# EAGLE design PULSE_OXIMETER_SHIELD (EAGLE 7.6.0)
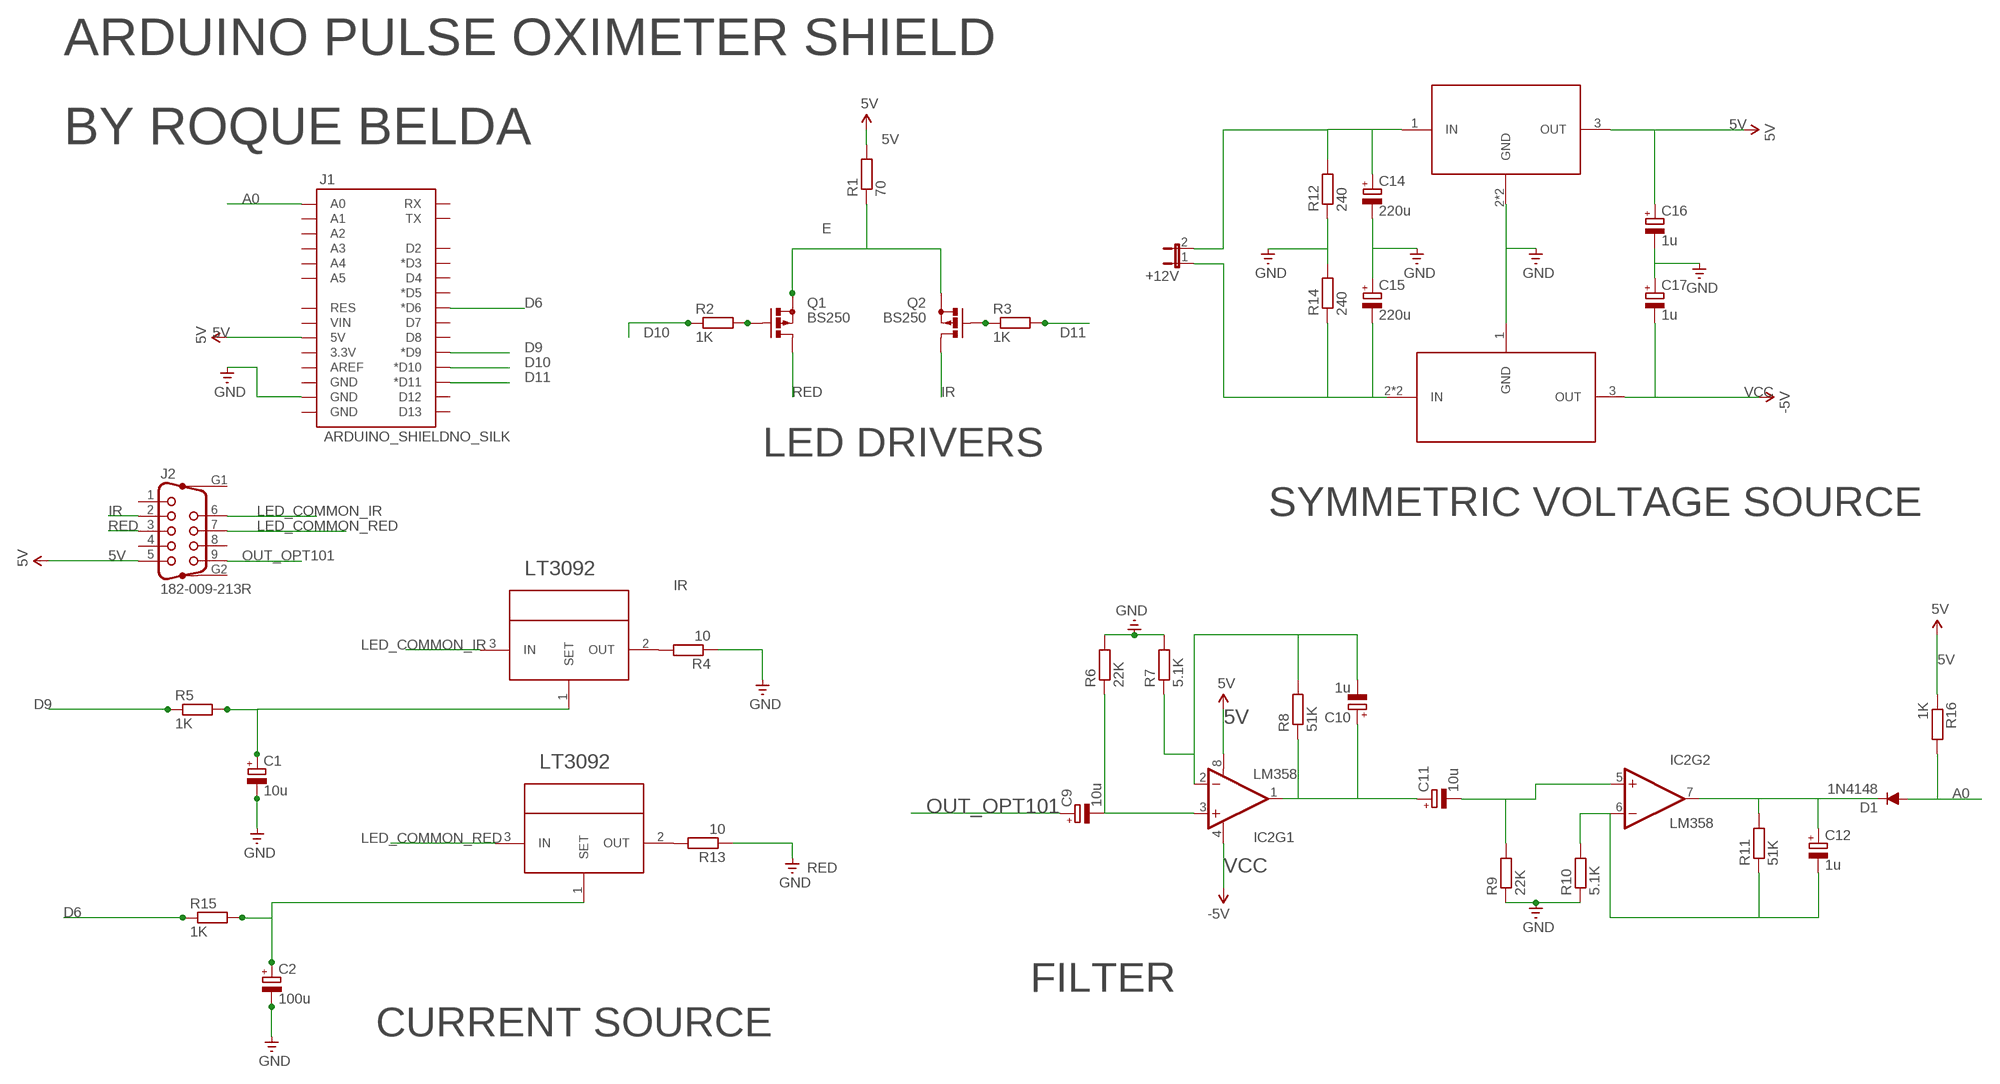
[diagram p0: schematic, sheet 1]

## Parts
+12V  JP1E  [JP1]
C1  10u  CPOL-EUE2.5-6  [E2,5-6]
C2  100u  CPOL-EUE2.5-6  [E2,5-6]
C9  10u  CPOL-EUE2.5-6  [E2,5-6]
C10  1u  CPOL-EUE2.5-6  [E2,5-6]
C11  10u  CPOL-EUE2.5-6  [E2,5-6]
C12  1u  CPOL-EUE2.5-6  [E2,5-6]
C14  220u  CPOL-EUE3.5-8  [E3,5-8]
C15  220u  CPOL-EUE3.5-8  [E3,5-8]
C16  1u  CPOL-EUE2.5-6  [E2,5-6]
C17  1u  CPOL-EUE2.5-6  [E2,5-6]
D1  1N4148  [DO35-10]
IC2  LM358  [DIP08]
J1  ARDUINO_SHIELDNO_SILK  [DUEMILANOVE_VIAS]
J2  182-009-213R  [182-009-213R]
Q1  BS250  [SOT54E]
Q2  BS250  [SOT54E]
R1  70  R-EU_0204/5  [0204/5]
R2  1K  R-EU_0204/5  [0204/5]
R3  1K  R-EU_0204/5  [0204/5]
R4  10  R-EU_0204/5  [0204/5]
R5  1K  R-EU_0204/5  [0204/5]
R6  22K  R-EU_0204/5  [0204/5]
R7  5.1K  R-EU_0204/5  [0204/5]
R8  51K  R-EU_0204/5  [0204/5]
R9  22K  R-EU_0204/5  [0204/5]
R10  5.1K  R-EU_0204/5  [0204/5]
R11  51K  R-EU_0204/5  [0204/5]
R12  240  R-EU_0204/5  [0204/5]
R13  10  R-EU_0204/5  [0204/5]
R14  240  R-EU_0204/5  [0204/5]
R15  1K  R-EU_0204/5  [0204/5]
R16  1K  R-EU_0204/5  [0204/5]
U$1  LT3092  [SOT223]
U$2  UA78M05  [SOT223]
U$3  UA79M05  [TO263-3]
U$4  LT3092  [SOT223]

## Nets
5V: C16.+ IC2.8(V+) J1.5V J2.5 R1.2 R16.1 U$2.3(OUT)
A0: D1.A J1.A0 R16.2
C10: C10.+ C11.+ IC2.1(OUT) R8.1
D6: J1.D6(*D6) R15.1
D9: J1.D9(*D9) R5.1
D10: J1.D10(*D10) R2.1
D11: J1.D11(*D11) R3.2
E: Q1.S Q2.S R1.1
GND: C1.- C2.- C14.- C15.+ J1.GND@1(GND) R4.1 R6.2 R7.2 R9.1 R10.1 R13.1 U$2.2(GND) U$2.4(GND) U$3.1(GND)
IR: J2.2 Q2.D
LED_COMMON_IR: J2.6 U$1.3(IN)
LED_COMMON_RED: J2.7 U$4.3(IN)
N$1: Q1.G R2.2
N$2: Q2.G R3.1
N$3: R4.2 U$1.2(OUT)
N$4: C2.+ R15.2 U$4.1(SET)
N$5: C1.+ R5.2 U$1.1(SET)
N$6: C11.- IC2.5(+IN) R9.2
N$7: R13.2 U$4.2(OUT)
N$8: C12.+ D1.C IC2.7(OUT) R11.2
N$9: C16.- C17.+
N$10: +12V.2 C14.+ R12.2 U$2.1(IN)
N$11: R12.1 R14.2
N$12: +12V.1 C15.- R14.1 U$3.2(IN) U$3.4(IN)
N$17: C10.- IC2.2(-IN) R7.1 R8.2
N$20: C9.- IC2.3(+IN) R6.1
OUT_OPT101: C9.+ J2.9
R11: C12.- IC2.6(-IN) R10.2 R11.1
RED: J2.3 Q1.D
VCC: C17.- IC2.4(V-) U$3.3(OUT) ; supply symbol labelled -5V
Unconnected: J1.3.3V J1.A1 J1.A2 J1.A3 J1.A4 J1.A5 J1.AREF J1.D2 J1.D3(*D3) J1.D4 J1.D5(*D5) J1.D7 J1.D8 J1.D12 J1.D13 J1.GND@0(GND) J1.GND@2(GND) J1.RES J1.RX J1.TX J1.VIN J2.1 J2.4 J2.8 J2.G1 J2.G2

## Notes on the sheet
- ARDUINO PULSE OXIMETER SHIELD
- BY ROQUE BELDA
- LED DRIVERS
- SYMMETRIC VOLTAGE SOURCE
- IR
- RED
- FILTER
- CURRENT SOURCE

## Library data of the parts
+12V = jumper:JP1E: JUMPER
C1 C2 C9-C12 C14-C17 = resistor:CPOL-EU: POLARIZED CAPACITOR, European symbol
D1 = diode (2):1N4148: DIODE high speed (Philips)
IC2 = SparkFun-AnalogIC:LM358: Jellybean op-amp; PROD_ID: IC-09172
J1 = SparkFun-Boards:ARDUINO_SHIELD: Arduino shield footprint
J2 = con-subd (2):182-009-213R: CONN DB9 FEMALE .318" R/A NICKEL
Q1 Q2 = transistor-small-signal:BS250: P-CHANNEL MOS FET
R1-R16 = rcl:R-EU_: RESISTOR, European symbol
U$1 U$4 = transistor-npn:LT3092
U$2 = transistor-npn:UA78M05
U$3 = lm1084-adj-to263:UA79M05

## Board
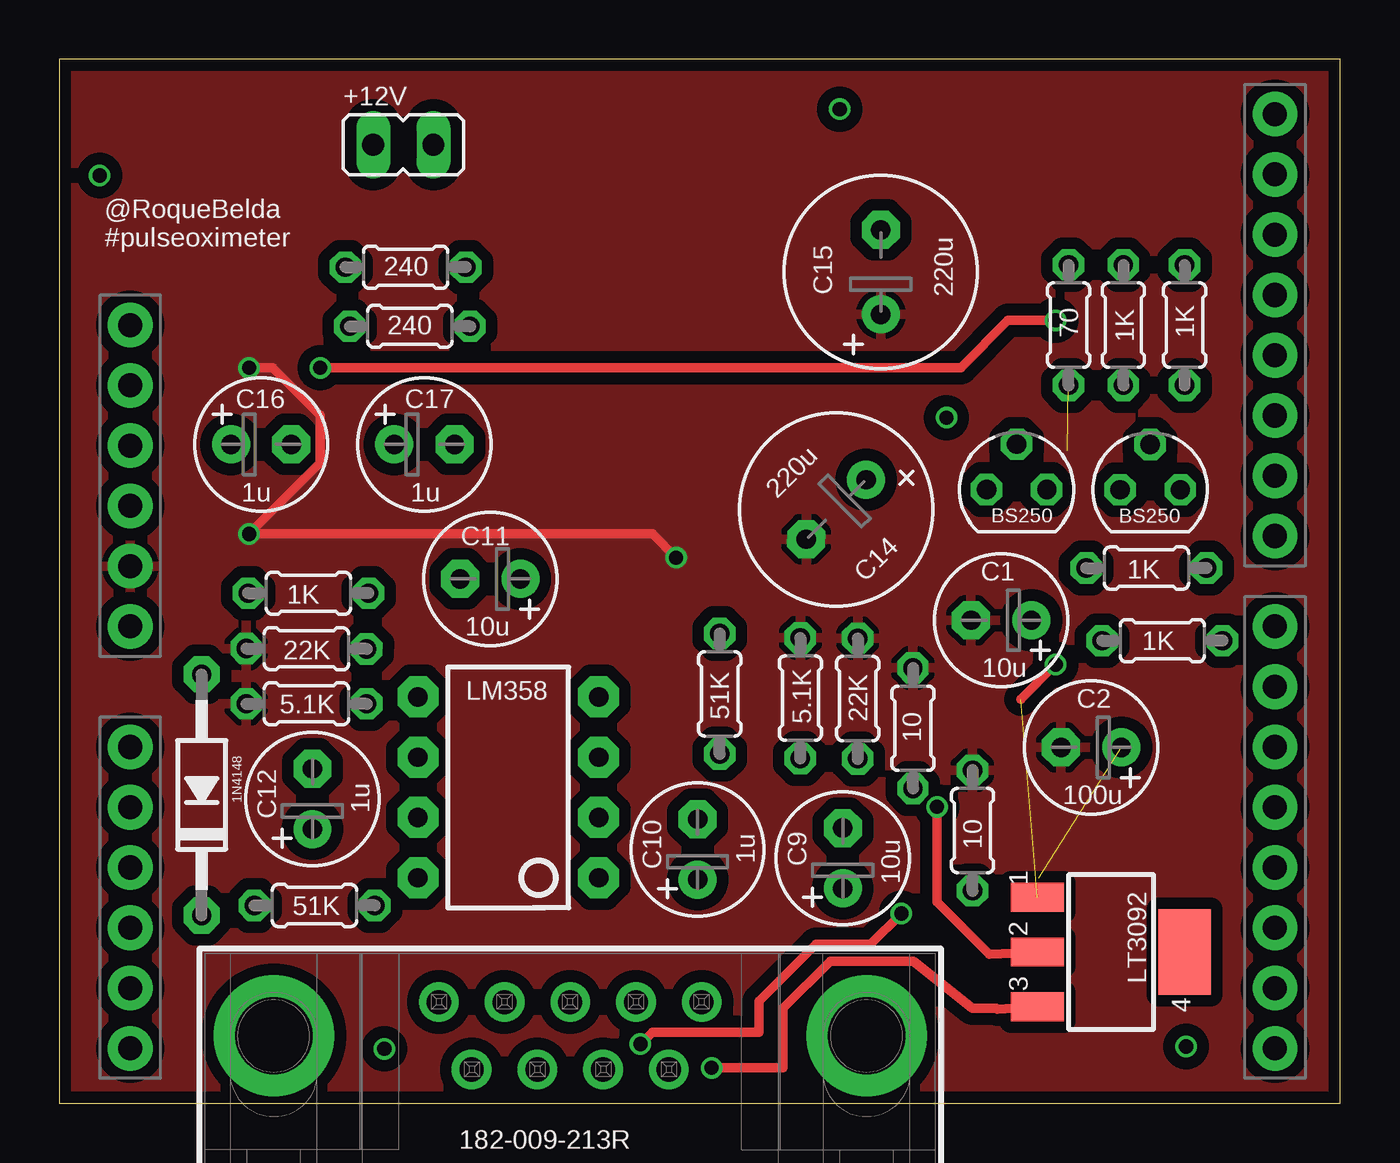
[diagram p1: board, top side]
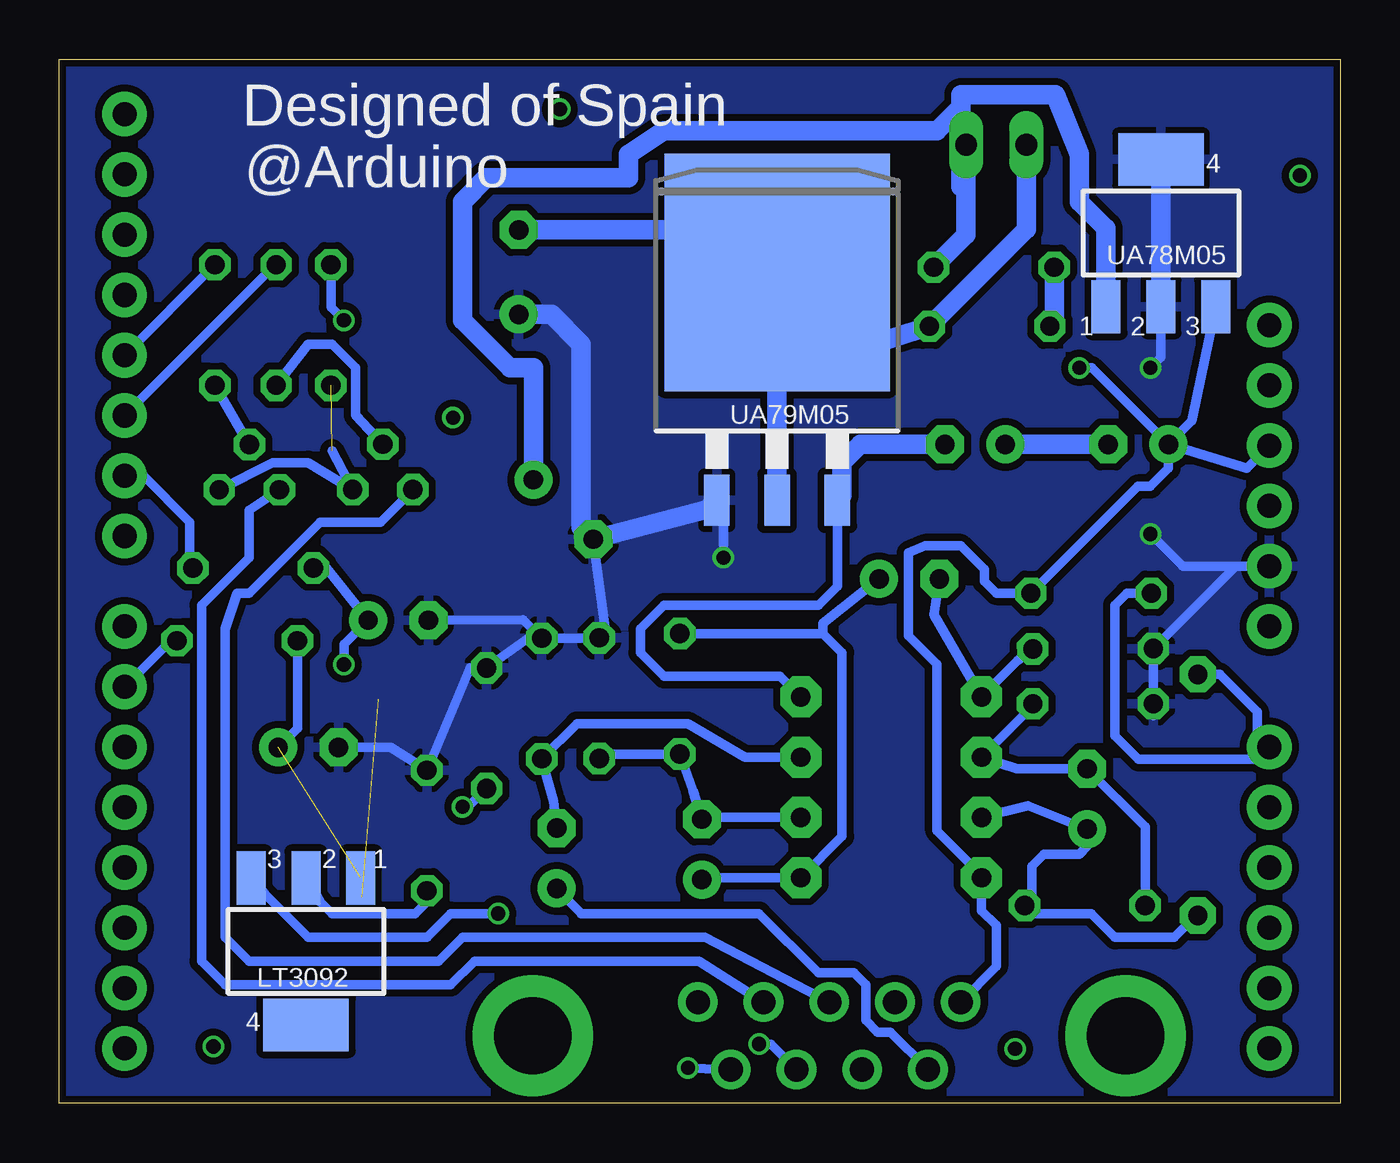
[diagram p2: board, bottom side, seen from below]

Size 54 x 44 mm. Coordinates in mm from the lower left corner, seen from the top.
Outline: 0,0 54,0 54,44 0,44 0,0
Copper layers (1*16): Top 0.035mm / dielectric 1.5mm / Bottom 0.035mm
Design rules "ITead_rule": minimum track width 6mil, minimum drill 12mil, track to track 6mil, track to pad 6mil, pad to pad 6mil, via to via 6mil, smd to smd 0mil, copper to edge 10mil, drill to drill 10mil, minimum pad ring 10mil, minimum via ring 6mil, stop-mask expansion 2mil, vias tented up to drill 100mil, thermal gap 10mil

### Footprints (pad centres in the part's own frame; a part is rotated, then mirrored left to right if it is on the bottom)
JP1 = drill 0.914 long: 1 0,-1.27; 2 0,1.27
E2,5-6 = drill 0.813 pad 1.6: + -1.27,0 | drill 0.813 pad 1.6 octagon: - 1.27,0
E3,5-8 = drill 0.813 pad 1.6: + -1.778,0 | drill 0.813 pad 1.6 octagon: - 1.778,0
DO35-10 = drill 0.813 pad 1.524 octagon: A 5.08,0; C -5.08,0
DIP08 = drill 0.813 pad 1.727 octagon: 1 -3.81,-3.81; 2 -1.27,-3.81; 3 1.27,-3.81; 4 3.81,-3.81; 5 3.81,3.81; 6 1.27,3.81; 7 -1.27,3.81; 8 -3.81,3.81
DUEMILANOVE_VIAS = drill 1.016 pad 1.88: 3.3V 50.8,13.97; 5V 50.8,16.51; A0 50.8,29.21; A1 50.8,31.75; A2 50.8,34.29; A3 50.8,36.83; A4 50.8,39.37; A5 50.8,41.91; AREF 2.54,2.54; D2 2.54,36.83; D3 2.54,34.29; D4 2.54,31.75; D5 2.54,29.21; D6 2.54,26.67; D7 2.54,24.13; D8 2.54,20.32; D9 2.54,17.78; D10 2.54,15.24; D11 2.54,12.7; D12 2.54,10.16; D13 2.54,7.62; GND@0 50.8,19.05; GND@1 50.8,21.59; GND@2 2.54,5.08; RES 50.8,11.43; RX 2.54,41.91; TX 2.54,39.37; VIN 50.8,24.13
182-009-213R = drill 1.016 pad 1.676: 1 -5.54,-1.42; 2 -2.77,-1.42; 3 0,-1.42; 4 2.77,-1.42; 5 5.54,-1.42; 6 -4.155,1.42; 7 -1.385,1.42; 8 1.385,1.42; 9 4.155,1.42 | drill 3.251 pad 5.08: G1 -12.495,0; G2 12.495,0
SOT54E = drill 0.813 octagon: D -1.27,0; G 0,1.905; S 1.27,0
0204/5 = drill 0.813 octagon: 1 -2.54,0; 2 2.54,0
SOT223 = smd 1.219 x 2.235: 1 -2.311,-3.099; 2 0,-3.099; 3 2.311,-3.099 | smd 3.6 x 2.2: 4 0,3.099
TO263-3 = smd 1.067 x 2.159: 1 -2.54,-5.791; 2 0,-5.791; 3 2.54,-5.791 | smd 9.5 x 10: 4 0,3.81

### Placement (x,y rotation side)
+12V  14.5,40.4 270 top
C1  39.71,20.36 180 top
C2  43.5,15 180 top
C9  33.03,10.33 90 top
C10  26.91,10.7 90 top
C11  18.17,22.1 180 top
C12  10.67,12.83 90 top
C14  32.75,25.03 224.8 top
C15  34.63,35.03 90 top
C16  8.51,27.77 0 top
C17  15.39,27.77 0 top
D1  6,13 90 top
IC2  18.93,13.32 90 top
J1  53.79,44.23 180 top
J2  21.54,2.85 180 top
Q1  40.36,25.87 0 top
Q2  45.99,25.86 0 top
R1  42.55,32.8 90 top
R2  44.86,32.8 270 top
R3  47.44,32.8 90 top
R4  35.99,15.81 270 top
R5  45.83,22.56 180 top
R6  33.66,17.06 90 top
R7  31.24,17.08 90 top
R8  27.84,17.26 270 top
R9  10.42,19.16 359.8 top
R10  10.42,16.84 0 top
R11  10.76,8.34 0 top
R12  14.6,35.24 0 top
R13  38.5,11.5 270 top
R14  14.78,32.75 180 top
R15  46.5,19.5 180 top
R16  10.5,21.5 180 top
U$1  44.34,6.38 270 top
U$2  7.56,36.68 0 bottom
U$3  23.74,31.21 0 bottom
U$4  43.6,6.4 180 bottom

### Tracks (layer width: path | path; a pad name or v marks a point on that pad's centre or on a via)
5V  (via drill 0.6)
  Top 0.406: v42,33 40,33 38,31 v11,31
  Bottom 0.406: J2.5 14.5,5.77 14.5,7.5 15.12,8.12 IC2.8 15.12,9.62 17,11.5 17,18.5 18.2,19.7 18.2,23.2 17.5,23.5 16,23.5 15,22.5 15,22 14.5,21.5 R16.1 8.54,26 8,26 7.24,26.76 C16.+ | C16.+ 3.94,26.77 J1.5V | U$2.3 6.25,28.76 C16.+ | R1.2 42.55,33.55 v42,33 | v11,31 10.47,31 C16.+
A0
  Bottom 0.406: D1.A 5.08,18.08 3.5,16.5 3.5,15.53 J1.A0 3.51,14.5 8.5,14.5 9.5,15.5 9.5,21 9,21.5 R16.2
C10
  Bottom 0.406: 21.8,19.8 21,19 21,11.25 IC2.1 26.49,9.51 C10.+ | 21.8,19.8 R8.1 | C11.+ 21.8,20.24 21.8,19.8
D6
  Bottom 0.406: R15.1 49.31,19.5 J1.D6
D9
  Bottom 0.406: J1.D9 50.45,26.45 48.5,24.5 48.5,22.69 R5.1
D10
  Bottom 0.406: R2.1 44.9,35.34 J1.D10
D11
  Bottom 0.406: R3.2 J1.D11
E  (1 unrouted)
  Bottom 0.406: 42.5,27.5 Q1.S 43.5,27 45,27 Q2.S
GND  (via drill 0.6)
  Top 0.406: v26,23 25,24 v8,24 11,27 11,29 9,31 v8,31
  Bottom 0.406: R6.2 34.44,20.38 C1.- | R6.2 31.26,19.6 R7.2 30.97,19.89 C14.- | R6.2 34.24,19.6 R4.1 36.69,18.35 R13.1 40.04,15 C2.- | R10.1 7.88,16.34 R9.1 4.41,22.64 | J1.GND@1 4.41,22.64 | 4.41,22.64 6.64,22.64 v8,24 | v26,23 26,25.14 U$3.1 | U$2.2 7.56,31.44 v8,31
  Bottom 0.813: U$2.2 U$2.4 | U$3.1 26.67,25.03 C14.- 32,24.29 32,32 33.25,33.25 C15.+
  pour Top (isolate 0.5): 0,43.5 54,44 54,0.1 0,-0.4
  pour Bottom (isolate 0.3): 0,44 -0.3,-1.2 53.7,-1.2 54,44
IR
  Bottom 0.406: Q2.D 46,25 46,23 48,21 48,6 47,5 37.5,5 36.5,6 27.04,6 J2.2
LED_COMMON_IR  (via drill 0.6)
  Top 0.406: v27.5,1.5 30.5,1.5 30.5,4 32.5,6 36,6 38.5,4 39.51,4 39.54,3.97 U$1.3
  Bottom 0.406: v27.5,1.5 26.43,1.43 J2.6
LED_COMMON_RED  (via drill 0.6)
  Top 0.406: v24.5,2.5 25,3 29.5,3 29.5,4.3 31.9,6.7 34.2,6.7 v35.5,8
  Bottom 0.406: U$4.3 45.31,8.81 43.5,7 38.5,7 37.5,8 v35.5,8 | v24.5,2.5 24,2.5 J2.7
N$1
  Bottom 0.406: R2.2 43.5,32 42.5,32 41.5,31 41.5,29 Q1.G
N$2
  Bottom 0.406: R3.1 Q2.G
N$3  (via drill 0.6)
  Top 0.406: U$1.2 39.22,6.28 37,8.5 v37,12.5
  Bottom 0.406: v37,12.5 36.76,12.5 R4.2
N$4  (1 unrouted)
  Bottom 0.406: R15.2 43.96,15.81 C2.+
N$5  (via drill 0.6)  (1 unrouted)
  Top 0.406: 40.54,17.04 v42,18.5
  Bottom 0.406: R5.2 42.99,22.86 C1.+ 42,19.34 v42,18.5
N$6
  Bottom 0.406: C11.- 17.12,20.6 IC2.5 13.6,18.65 R9.2
N$7
  Bottom 0.406: R13.2 38.5,8.5 39,8 42.5,8 43,8.5 U$4.2
N$8
  Bottom 0.406: IC2.7 13.17,12.55 C12.+ 10.67,10.83 11,10.5 12.5,10.5 13,10 13,8.64 R11.2 12.96,8 10.5,8 9.5,7 7,7 6.08,7.92 D1.C
N$9
  Bottom 0.813: C16.- C17.+
N$10
  Bottom 0.813: R12.2 15.77,36.61 +12V.2 16,38.63 16,42 | U$2.1 9.87,36.87 11,38 11,40 12,42.5 16,42.5 16,42 | C14.+ 34.01,30.99 34,31 35,31 37,33 37,38 36,39 30,39 30,40 28.5,41 17,41 16,42
N$11
  Bottom 0.813: R12.1 12.06,32.93 R14.2
N$12
  Bottom 0.813: U$3.4 20.47,31.75 R14.1 13.23,36.84 +12V.1 | U$3.2 U$3.4 | C15.- 24.81,36.81 24,36 24,35.28 U$3.4
N$17
  Bottom 0.406: R7.1 31.06,14.72 R8.2 27.29,13.17 C10.- 26.49,12.05 IC2.2
N$20
  Bottom 0.406: C9.- 33.16,12.73 R6.1 32.18,16 27.5,16 25.09,14.59 IC2.3
OUT_OPT101
  Bottom 0.406: J2.9 18.95,3 19.5,3 20,3.5 20,5 20.5,5.5 22,5.5 24.5,8 32,8 32.03,8.03 C9.+
R11
  Bottom 0.406: R11.1 8.22,11.65 C12.- 13.63,14.1 IC2.6 12.96,16.75 R10.2
RED
  Bottom 0.406: Q1.D 40.46,24.5 43,24.5 46,21.5 46.5,21.5 47,20 47,7 46,6 38,6 37,7 26.77,7 J2.3
S$1  (via drill 0.6)
  other vias: 32.9,41.9
S$2  (via drill 0.6)
  other vias: 37.4,28.9
S$3  (via drill 0.6)
  other vias: 47.5,2.4
S$4  (via drill 0.6)
  other vias: 13.7,2.3
S$5  (via drill 0.6)
  other vias: 1.7,39.1
VCC
  Bottom 0.406: U$3.3 21.2,21.8 22,21 28.5,21 29.5,20 29.5,19 28.5,18 23.61,18 IC2.4
  Bottom 0.813: C17.- 20.23,27.77 21,27 21,25.62 U$3.3

### Text on the board
tPlace: @RoqueBelda | #pulseoximeter
bPlace: Designed of Spain | @Arduino